# Altium project Power-Factor-Correction.PrjPcb (part 1 of 2)
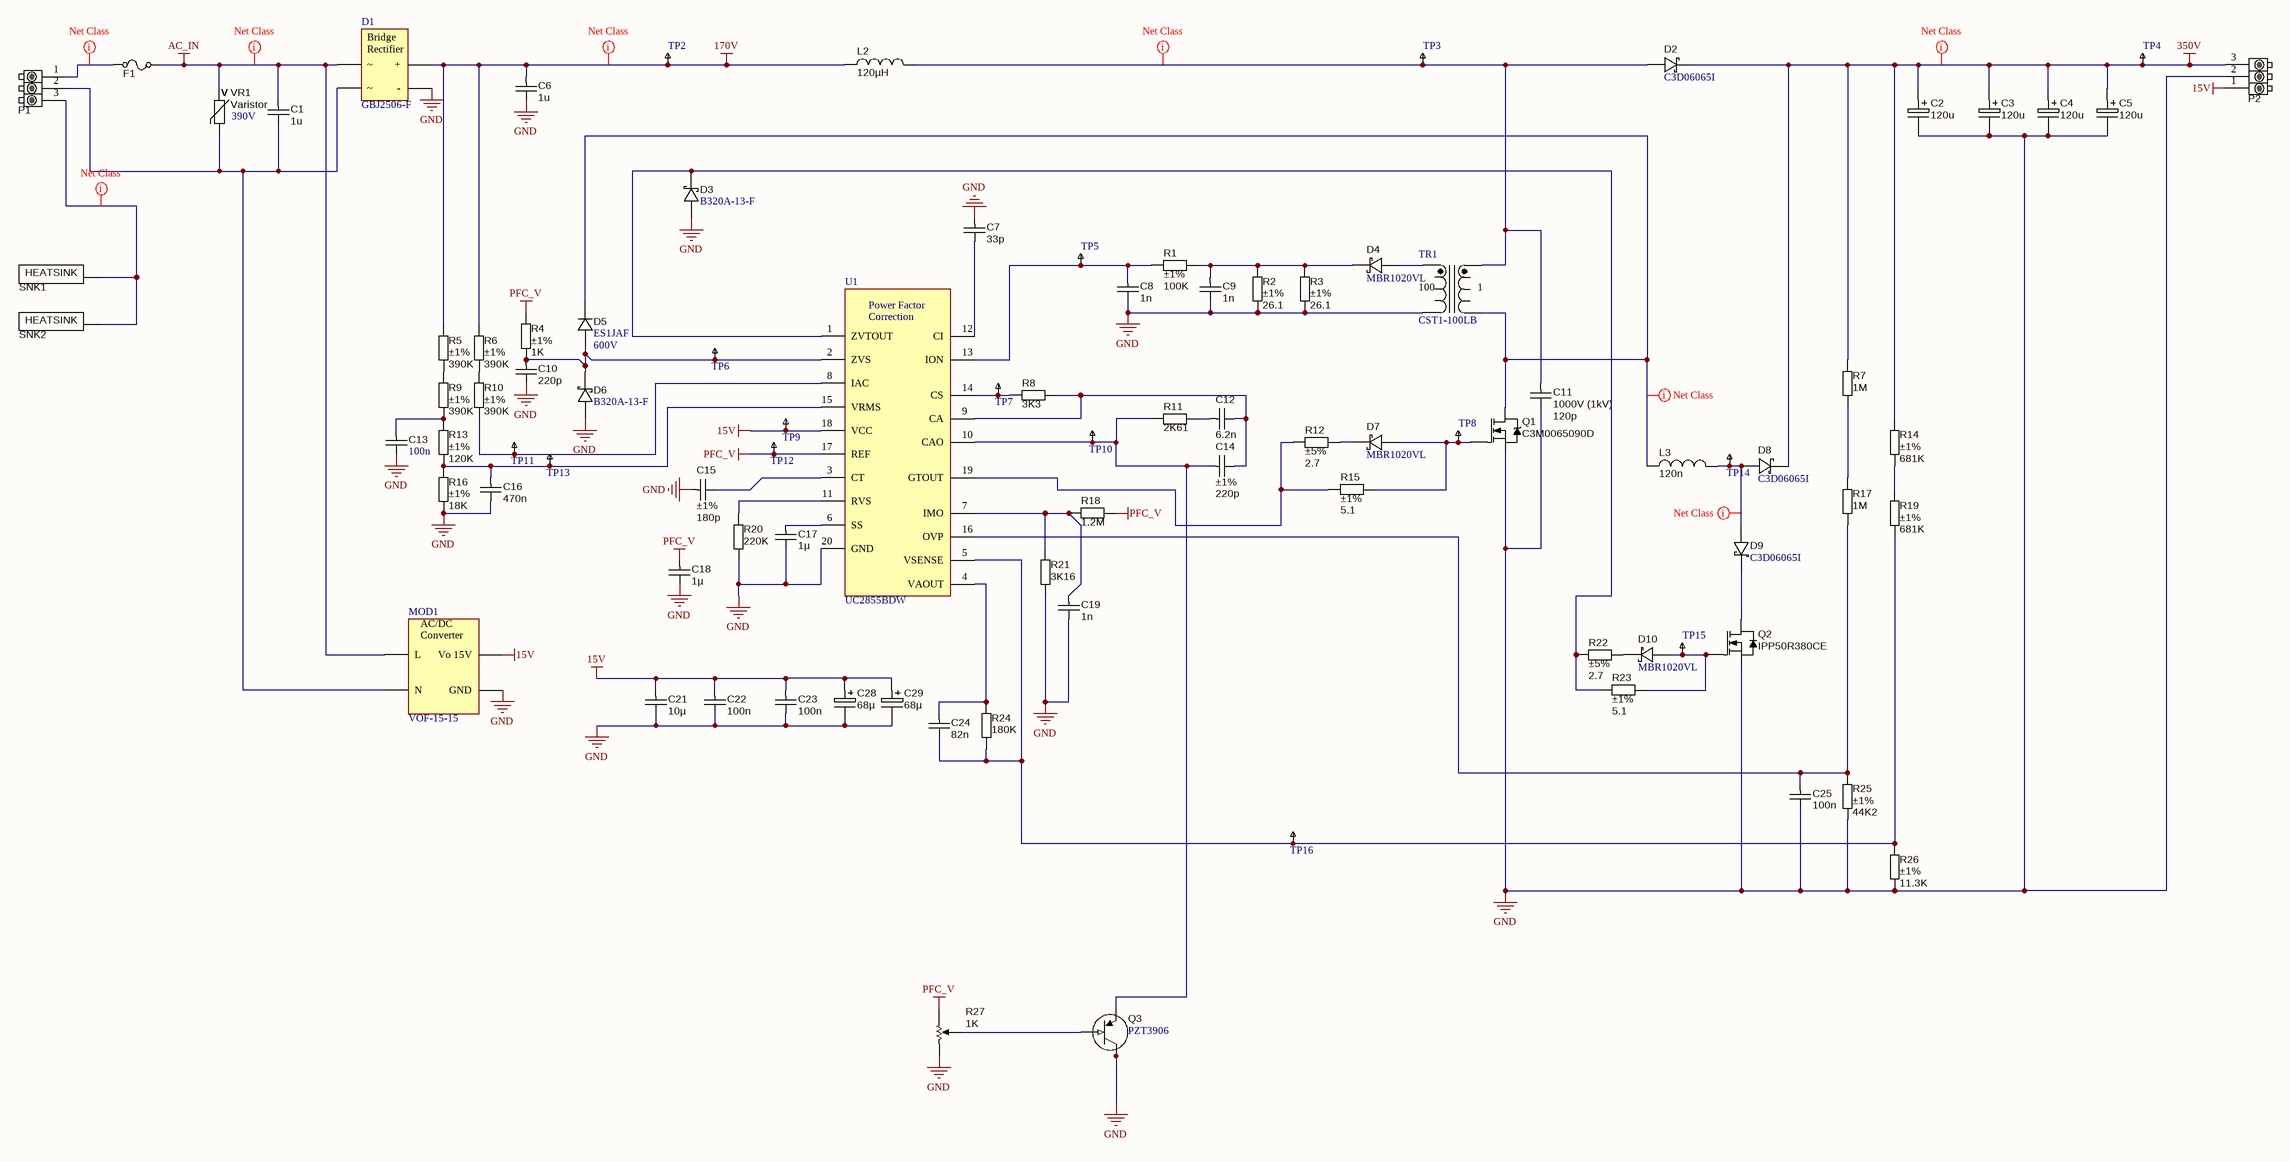
[diagram p0: Power Factor Correction.SchDoc]
1 sheet, 92 parts. Net scope: global (net labels, ports and power ports of the same name join across sheets).
Board file: VFD.PcbDoc

## Sheet Power Factor Correction.SchDoc
size C

### Parts
C1  value 1u  [R71MI4100AA30K]  (hidden comment: R71MI4100AA30K)
C2  120u  [Capacitor 22mmx25mm]
C3  120u  [Capacitor 22mmx25mm]
C4  120u  [Capacitor 22mmx25mm]
C5  120u  [Capacitor 22mmx25mm]
C6  value 1u  [R71MI4100AA30K]  (hidden comment: R71MI4100AA30K)
C7  33p  [CAPC1608X90N]
C8  value 1n  [CAPC1608X90N]  (hidden comment: approved sub OK)
C9  value 1n  [CAPC1608X90N]  (hidden comment: approved sub OK)
C10  220p  [CAPC1608X90N]
C11  Voltage - Rated: 1000V (1kV)  [CAPC3216X180N]  (hidden comment: 120p)
C12  6.2n  [CAPC1608X90N]
C13  value 100n  [CAPC4532X280N]  (hidden comment: GRM43DR72J104KW01L)
C14  Tolerance: ±1%  [CAPC1608X90N]  (hidden comment: 220p)
C15  Tolerance: ±1%  [CAPC1608X90N]  (hidden comment: 180p)
C16  value 470n  [CAPC2012X135N]  (hidden comment: approved sub OK)
C17  value 1µ  [CAPC3216X180N]  (hidden comment: approved sub OK)
C18  value 1µ  [CAPC3216X180N]  (hidden comment: approved sub OK)
C19  value 1n  [CAPC1608X90N]  (hidden comment: approved sub OK)
C21  10µ  [CAPC3225X220N]
C22  value 100n  [CAPC2012X135N]  (hidden comment: approved sub OK)
C23  value 100n  [CAPC2012X135N]  (hidden comment: approved sub OK)
C24  value 82n  [CAPC1608X90N]  (hidden comment: approved sub OK)
C25  value 100n  [CAPC1608X90N]  (hidden comment: approved sub OK)
C28  value 68µ  [CAP_POLY_HXB_F80]  (hidden comment: HHXB350ARA680MF80G)
C29  value 68µ  [CAP_POLY_HXB_F80]  (hidden comment: HHXB350ARA680MF80G)
D1  GBJ2506-F  [4-SIP, GBJ]
D2  C3D06065I  [TO220-2]
D3  B320A-13-F  [DO-214AC]
D4  Manufacturer Part Number: MBR1020VL  [SOD123F]  (hidden comment: B320A-13-F)
D5  Voltage - DC Reverse (Vr) (Max): 600V  [DO-214AD  SMAF]  (hidden comment: ES1JAF)
D6  B320A-13-F  [DO-214AC]
D7  Manufacturer Part Number: MBR1020VL  [SOD123F]  (hidden comment: B320A-13-F)
D8  C3D06065I  [TO220-2]
D9  C3D06065I  [TO220-2]
D10  Manufacturer Part Number: MBR1020VL  [SOD123F]  (hidden comment: B320A-13-F)
F1  Slow-blow  [3AB 3AG fuseholder]  (value not drawn)
L2  120µH  [ETD 44 Horizontal]
L3  value 120n  [SLR1050]  (hidden comment: SLR1050B-121KE_)
MOD1  VOF-15-15  [VOF-15-15 4 DIP]
P1  *  [TE 796739-3 3 Screw Terminal]  (value not drawn)
P2  *  [TE 796739-3 3 Screw Terminal]  (value not drawn)
Q1  C3M0065090D  [TO-247-3]
Q2  IPP50R380CE  [TO220V-GDS]
Q3  Manufacturer Part Number: PZT3906  [SOT223]  (hidden comment: PNP)
R1  value 100K  Tolerance: ±1%  [RESC1608X55N]  (hidden comment: Thick Film)
R2  value 26.1  Tolerance: ±1%  [RESC2012X70N]  (hidden comment: Thick Film)
R3  value 26.1  Tolerance: ±1%  [RESC2012X70N]  (hidden comment: Thick Film)
R4  value 1K  Tolerance: ±1%  [RESC1608X55N]  (hidden comment: Thick Film)
R5  value 390K  Tolerance: ±1%  [RESC2012X70N]  (hidden comment: Thick Film)
R6  value 390K  Tolerance: ±1%  [RESC2012X70N]  (hidden comment: Thick Film)
R7  value 1M  [RESC2012X70N]  (hidden comment: Thick Film)
R8  value 3K3  [RESC1608X55N]  (hidden comment: Thick Film)
R9  value 390K  Tolerance: ±1%  [RESC2012X70N]  (hidden comment: Thick Film)
R10  value 390K  Tolerance: ±1%  [RESC2012X70N]  (hidden comment: Thick Film)
R11  value 2K61  [RESC1608X55N]  (hidden comment: Thick Film)
R12  value 2.7  Tolerance: ±5%  [RESC1608X55N]  (hidden comment: Thick Film)
R13  value 120K  Tolerance: ±1%  [RESC1608X55N]  (hidden comment: Thick Film)
R14  value 681K  Tolerance: ±1%  [RESC2012X70N]  (hidden comment: Thick Film)
R15  value 5.1  Tolerance: ±1%  [RESC1608X55N]  (hidden comment: Thick Film)
R16  value 18K  Tolerance: ±1%  [RESC1608X55N]  (hidden comment: Thick Film)
R17  value 1M  [RESC2012X70N]  (hidden comment: Thick Film)
R18  value 1.2M  [RESC1608X55N]  (hidden comment: Thick Film)
R19  value 681K  Tolerance: ±1%  [RESC2012X70N]  (hidden comment: Thick Film)
R20  value 220K  [RESC1608X55N]  (hidden comment: Thin Film)
R21  value 3K16  [RESC1608X55N]  (hidden comment: Thick Film)
R22  value 2.7  Tolerance: ±5%  [RESC1608X55N]  (hidden comment: Thick Film)
R23  value 5.1  Tolerance: ±1%  [RESC1608X55N]  (hidden comment: Thick Film)
R24  value 180K  [RESC1608X55N]  (hidden comment: Thick Film)
R25  value 44K2  Tolerance: ±1%  [RESC2012X70N]  (hidden comment: Thick Film)
R26  value 11.3K  Tolerance: ±1%  [RESC1608X55N]  (hidden comment: Thick Film)
R27  value 1K  [TrimPot_THT_2.54mm pitch]  (hidden comment: 25 Turn)
SNK1  OMNI-UNI-41-75  [OMNI-UNI-41-75]  (value not drawn)
SNK2  C247-025-1AE  [TO-247-2 With HeatSink 25mm]  (value not drawn)
TP2  *  [1206 Test Point]  (value not drawn)
TP3  *  [1206 Test Point]  (value not drawn)
TP4  *  [1206 Test Point]  (value not drawn)
TP5  *  [1206 Test Point]  (value not drawn)
TP6  *  [1206 Test Point]  (value not drawn)
TP7  *  [1206 Test Point]  (value not drawn)
TP8  *  [1206 Test Point]  (value not drawn)
TP9  *  [1206 Test Point]  (value not drawn)
TP10  *  [1206 Test Point]  (value not drawn)
TP11  *  [1206 Test Point]  (value not drawn)
TP12  *  [1206 Test Point]  (value not drawn)
TP13  *  [1206 Test Point]  (value not drawn)
TP14  *  [1206 Test Point]  (value not drawn)
TP15  *  [1206 Test Point]  (value not drawn)
TP16  *  [1206 Test Point]  (value not drawn)
TR1  CST1-100LB  [CST1]
U1  Manufacturer Part Number: UC2855BDW  [SOIC127P1030X265-20N]  (hidden comment: UC2855ADW)
VR1  Varistor  Varistor Voltage (Typ): 390V  [B722 14MM MOV]

### Nets
15V: C21.1 C22.1 C23.1 C28.1 C29.1 MOD1.Vo(Vo_15V) P2.1 TP9.1 U1.18(VCC)
170V: C6.1 D1.1(+) L2.1 R5.1 R6.1 TP2.1
350V: C2.1 C3.1 C4.1 C5.1 D2.1(K) D8.1(K) P2.3 R7.1 R14.1 TP4.1
AC_IN: C1.1 D1.2 F1.2 MOD1.L VR1.1
GND: C2.2 C3.2 C4.2 C5.2 C6.2 C7.1 C8.2 C9.2 C10.2 C11.2 C13.2 C15.1 C16.2 C17.2 C18.2 C19.2 C21.2 C22.2 C23.2 C25.2 C28.2 C29.2 D1.4(-) D3.A D6.A MOD1.GND P2.2 Q1.3(S) Q2.3(S) Q3.2(C) Q3.4(C) R2.2 R3.2 R16.2 R20.2 R21.2 R25.2 R26.2 R27.3(CW) TR1.4 U1.20(GND)
PFC_V: C18.1 R4.1 R18.1 R27.1(CCW) TP12.1 U1.17(REF)
NetC1_2: C1.2 D1.3 MOD1.N P1.2 VR1.2
NetC7_2: C7.2 U1.12(CI)
NetC8_1: C8.1 R1.1 TP5.1 U1.13(ION)
NetC9_1: C9.1 D4.K R1.2 R2.1 R3.1
NetC10_1: C10.1 D5.A D6.K R4.2 TP6.1 U1.2(ZVS)
NetC11_1: C11.1 D2.2(A) L2.2 TP3.1 TR1.8
NetC12_1: C12.1 R11.2
NetC12_2: C12.2 C14.2 R8.2 U1.9(CA)
NetC13_1: C13.1 R9.2 R13.1
NetC14_1: C14.1 Q3.3(E) R11.1 TP10.1 U1.10(CAO)
NetC15_2: C15.2 U1.3(CT)
NetC16_1: C16.1 R13.2 R16.1 TP13.1 U1.15(VRMS)
NetC17_1: C17.1 U1.6(SS)
NetC19_1: C19.1 R18.2 R21.1 U1.7(IMO)
NetC24_1: C24.1 R24.1 U1.4(VAOUT)
NetC24_2: C24.2 R19.2 R24.2 R26.1 TP16.1 U1.5(VSENSE)
NetC25_1: C25.1 R17.2 R25.1 U1.16(OVP)
NetD3_K: D3.K R22.1 R23.1 U1.1(ZVTOUT)
NetD4_A: D4.A TR1.6
NetD5_K: D5.K L3.1 Q1.2(D) TR1.7
NetD7_A: D7.A Q1.1(G) R15.2 TP8.1
NetD7_K: D7.K R12.2
NetD8_2: D8.2(A) D9.2(A) L3.2 TP14.1
NetD9_1: D9.1(K) Q2.2(D)
NetD10_A: D10.A Q2.1(G) R23.2 TP15.1
NetD10_K: D10.K R22.2
NetF1_1: F1.1 P1.1
NetP1_3: P1.3 SNK1.0(GND) SNK2.0(GND)
NetQ3_1: Q3.1(B) R27.2(TAP)
NetR5_2: R5.2 R9.1
NetR6_2: R6.2 R10.1
NetR7_2: R7.2 R17.1
NetR8_1: R8.1 TP7.1 U1.14(CS)
NetR10_2: R10.2 TP11.1 U1.8(IAC)
NetR12_1: R12.1 R15.1 U1.19(GTOUT)
NetR14_2: R14.2 R19.1
NetR20_1: R20.1 U1.11(RVS)

### Layout directives
net class HV: 170V, 350V, AC_IN, NetC11_1, NetD5_K, NetD8_2, NetF1_1, NetP1_3